# Altium schematic sheet main.SchDoc
size 594 x 420 mm; SheetNumber: 1; SheetTotal: 2
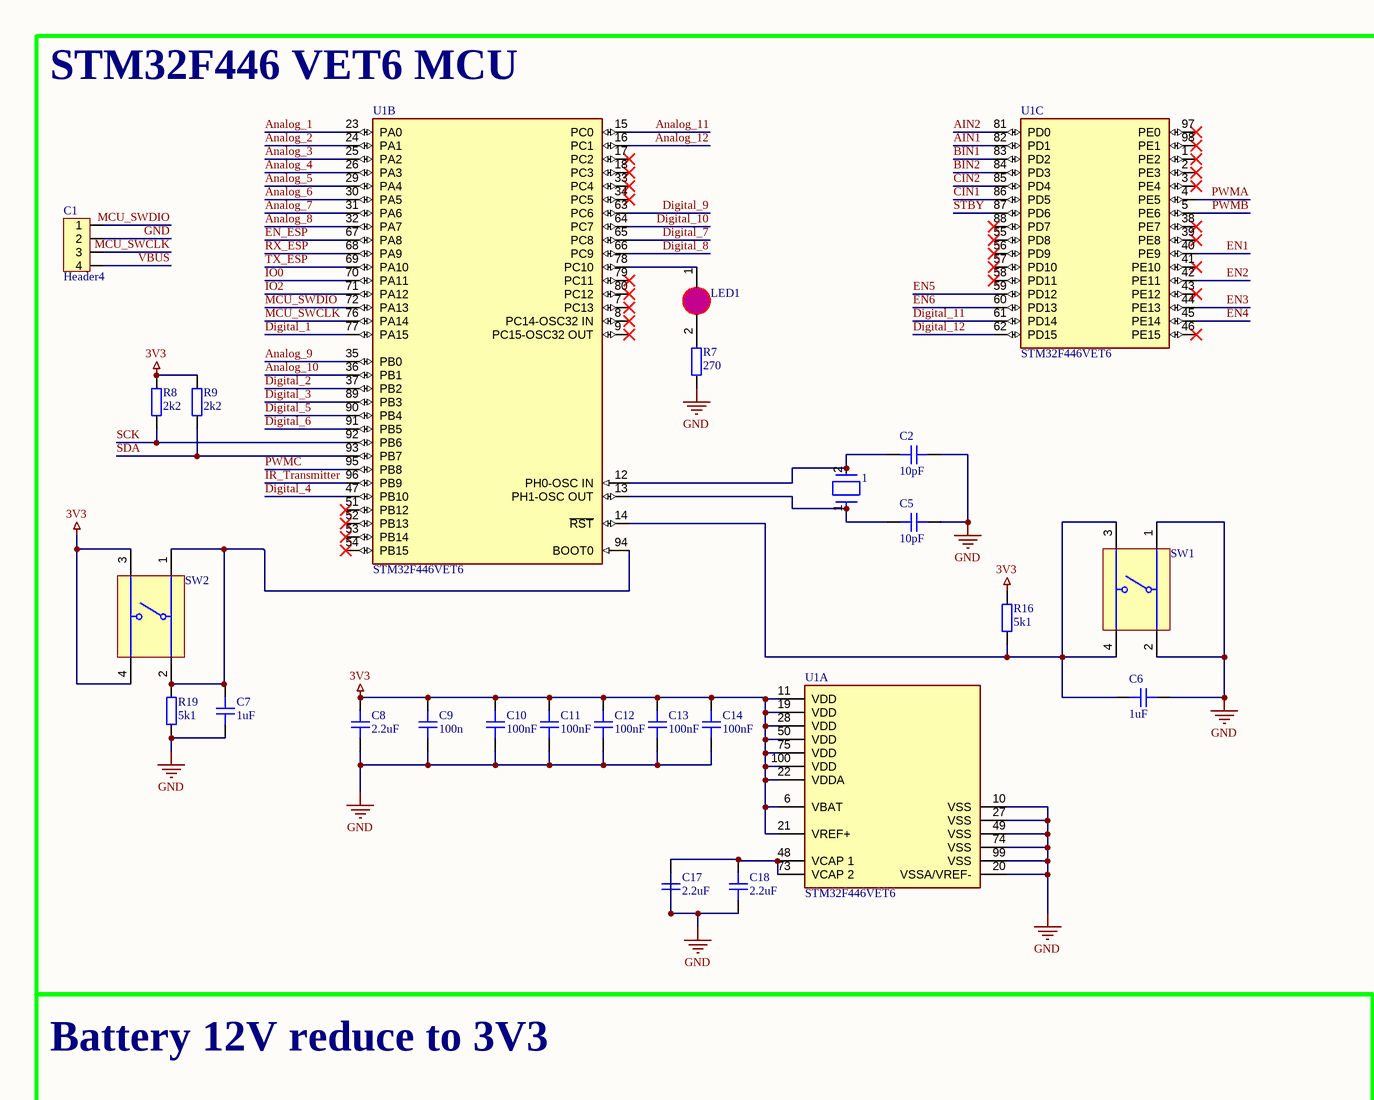
[diagram p0: main.SchDoc, top left]
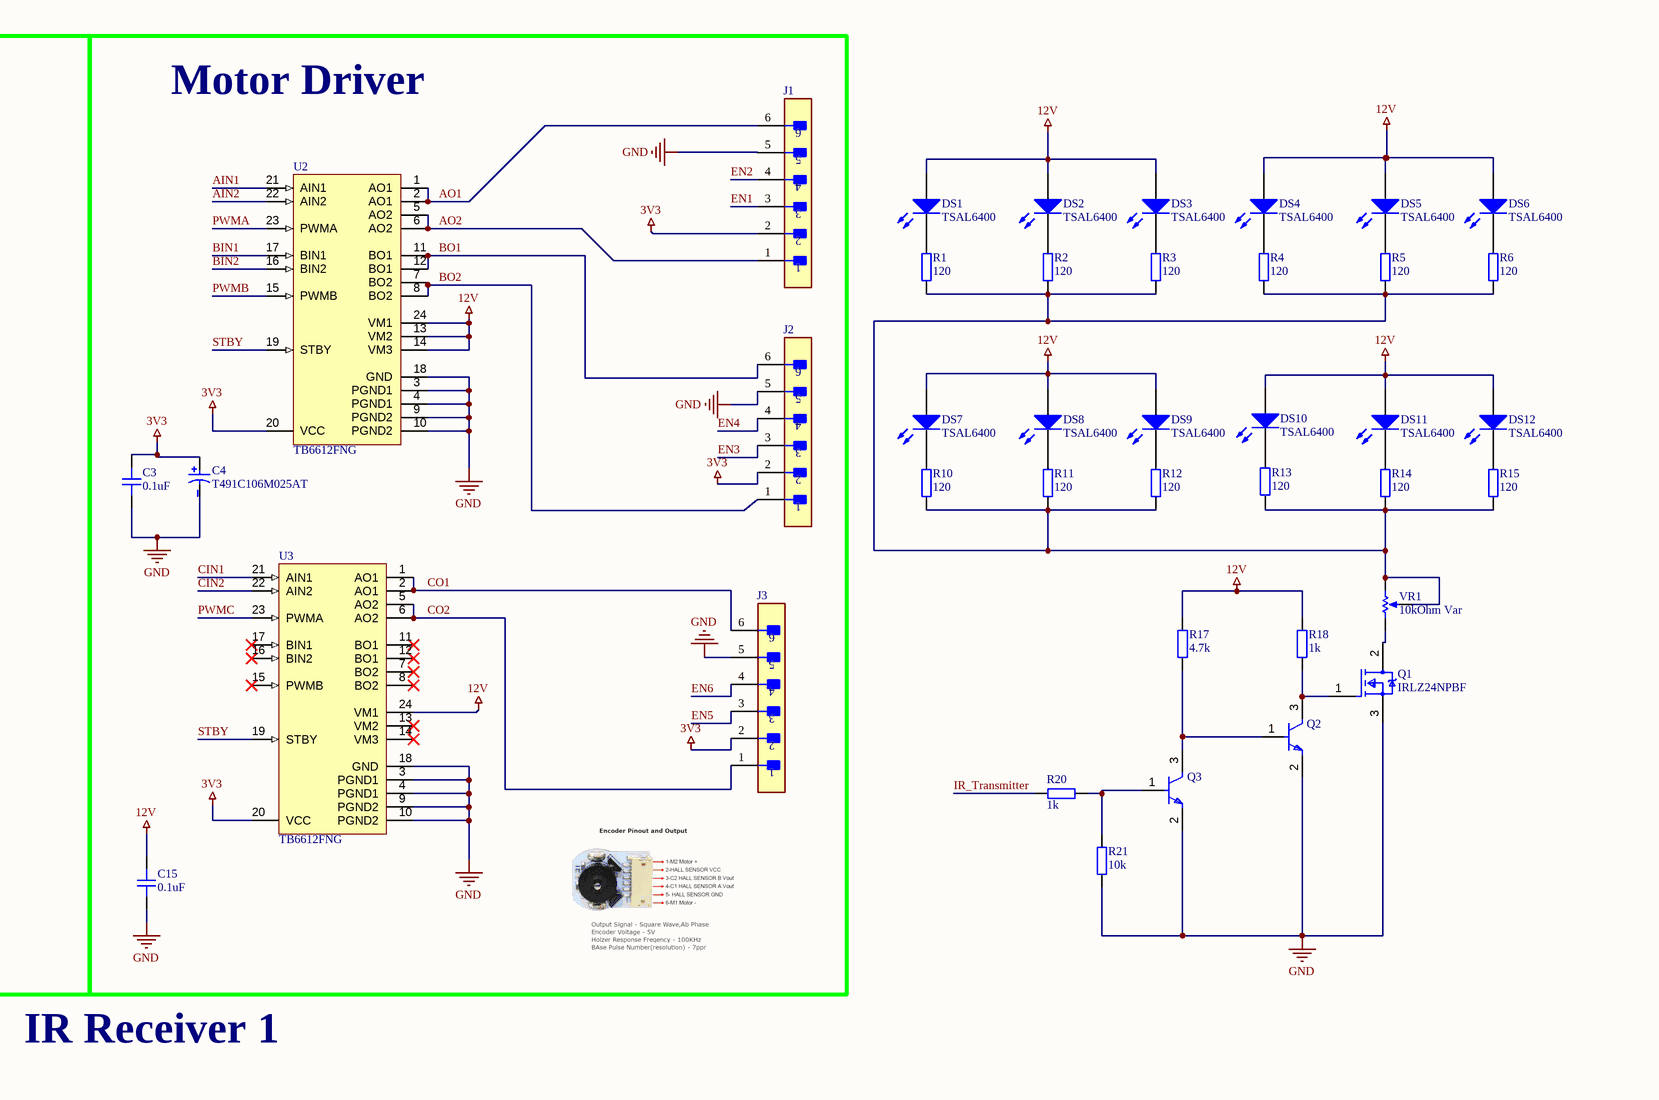
[diagram p1: main.SchDoc, top right]
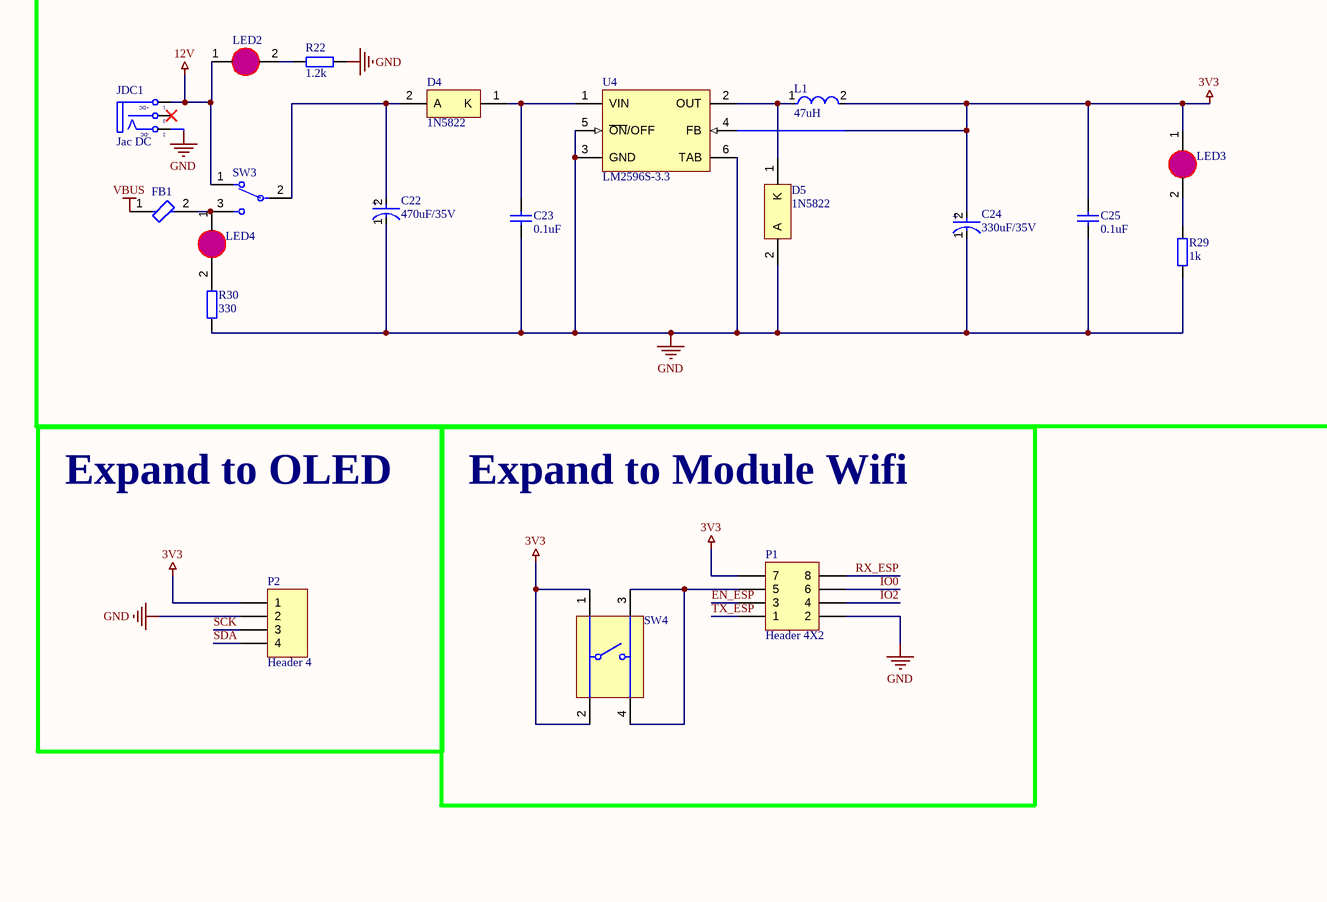
[diagram p2: main.SchDoc, bottom left]
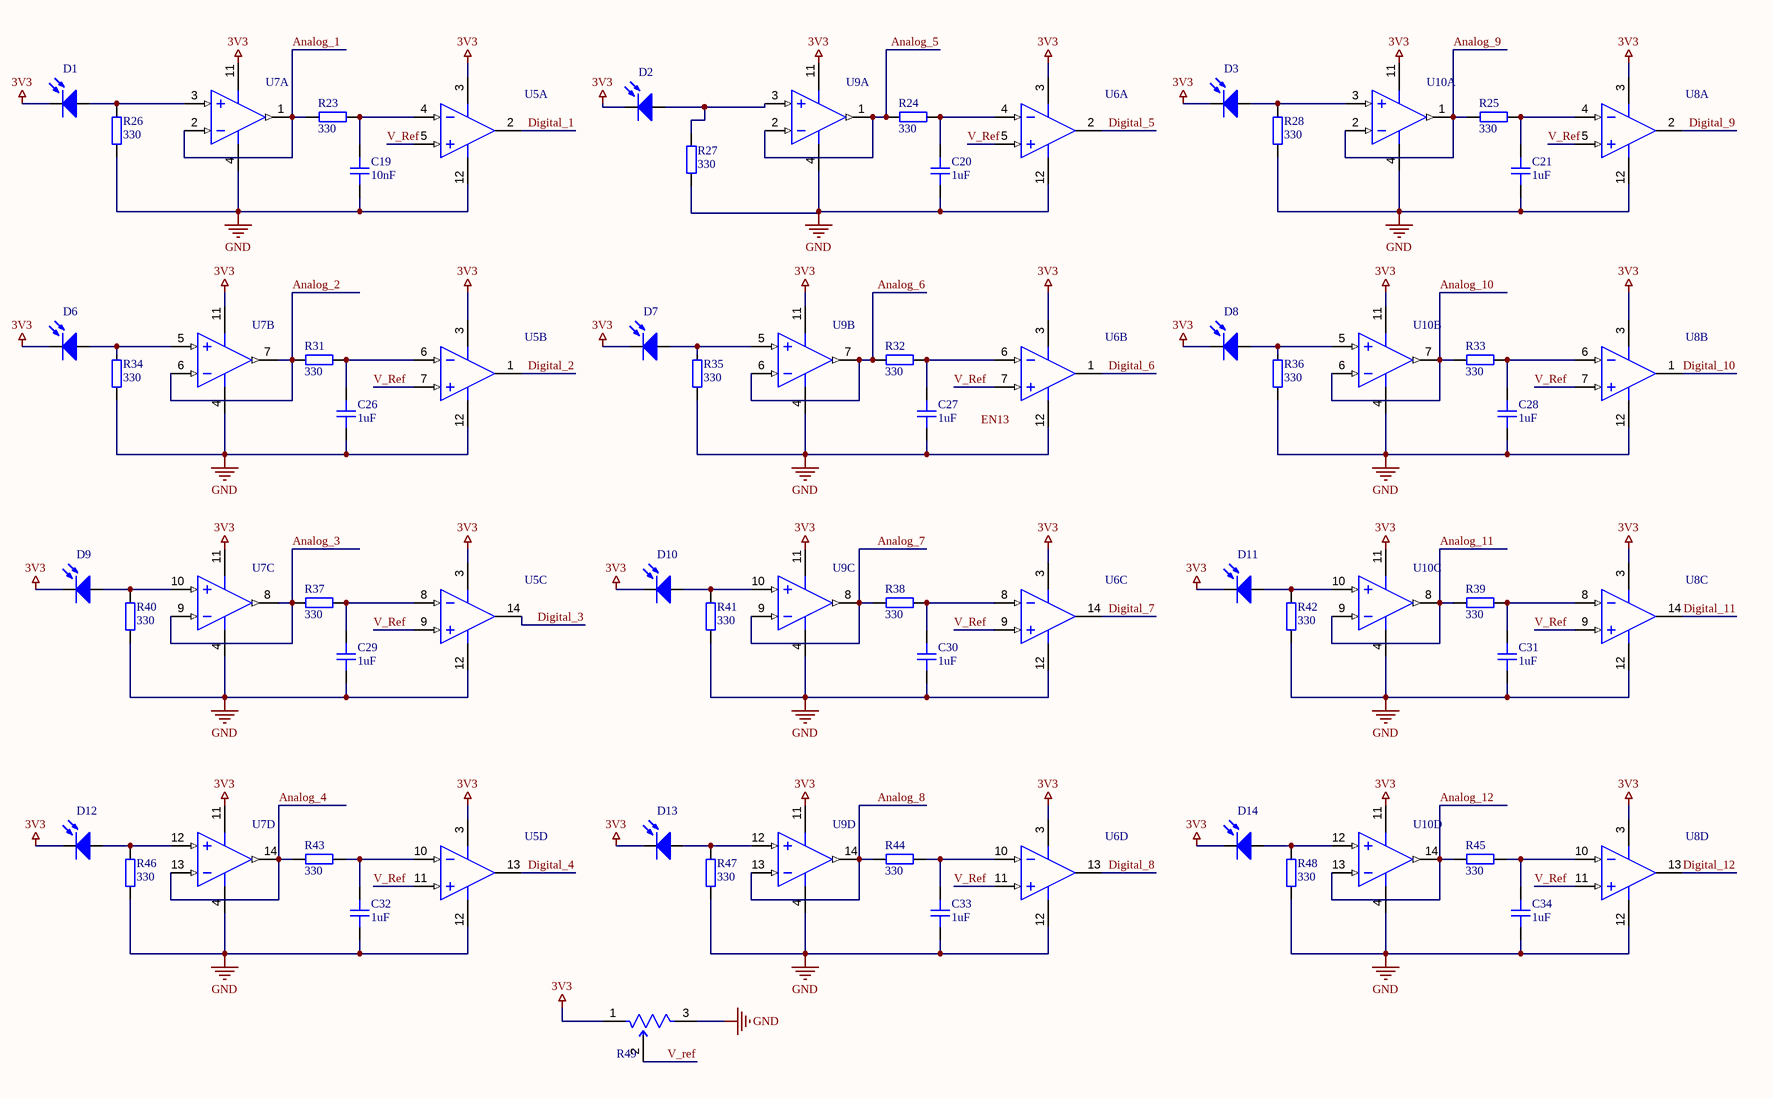
[diagram p3: main.SchDoc, bottom right]

## Parts
1  ABLS-8.000MHZ-B2-T  [FP-ABLS-MFG]  (value not drawn)
C1  Header4  [HDR4]
C2  10pF  [CAP_0603]
C3  0.1uF  [CAP_0603]
C4  T491C106M025AT  [KEMT-T491-C_L]
C5  10pF  [CAP_0603]
C6  1uF  [CAP_0603]
C7  1uF  [CAP_0603]
C8  2.2uF  [CAP_0603]
C9  100n  [CAP_0603]
C10  100nF  [CAP_0603]
C11  100nF  [CAP_0603]
C12  100nF  [CAP_0603]
C13  100nF  [CAP_0603]
C14  100nF  [CAP_0603]
C15  0.1uF  [CAP_0603]
C17  2.2uF  [CAP_0603]
C18  2.2uF  [CAP_0603]
C19  10nF  [CAP_0603]
C20  1uF  [CAP_0603]
C21  1uF  [CAP_0603]
C22  470uF/35V  [FP-RAD-TH-D_10_0_5-L_16_1-MFG]
C23  0.1uF  [CAPC1608X87X35LL15T15]
C24  330uF/35V  [FP-RAD-TH-D_10_0_5-L_12_5-MFG]
C25  0.1uF  [CAPC1608X87X35LL15T15]
C26  1uF  [CAP_0603]
C27  1uF  [CAP_0603]
C28  1uF  [CAP_0603]
C29  1uF  [CAP_0603]
C30  1uF  [CAP_0603]
C31  1uF  [CAP_0603]
C32  1uF  [CAP_0603]
C33  1uF  [CAP_0603]
C34  1uF  [CAP_0603]
D1  Photo Diode  [LED-5 GRe]  (value not drawn)
D2  Photo Diode  [LED-5 GRe]  (value not drawn)
D3  Photo Diode  [LED-5 GRe]  (value not drawn)
D4  1N5822  [ONSC-AXIAL_LEAD-2-267-05_V]
D5  1N5822  [ONSC-AXIAL_LEAD-2-267-05_V]
D6  Photo Diode  [LED-5 GRe]  (value not drawn)
D7  Photo Diode  [LED-5 GRe]  (value not drawn)
D8  Photo Diode  [LED-5 GRe]  (value not drawn)
D9  Photo Diode  [LED-5 GRe]  (value not drawn)
D10  Photo Diode  [LED-5 GRe]  (value not drawn)
D11  Photo Diode  [LED-5 GRe]  (value not drawn)
D12  Photo Diode  [LED-5 GRe]  (value not drawn)
D13  Photo Diode  [LED-5 GRe]  (value not drawn)
D14  Photo Diode  [LED-5 GRe]  (value not drawn)
DS1  TSAL6400  [VISH-TSAL6200]
DS2  TSAL6400  [VISH-TSAL6200]
DS3  TSAL6400  [VISH-TSAL6200]
DS4  TSAL6400  [VISH-TSAL6200]
DS5  TSAL6400  [VISH-TSAL6200]
DS6  TSAL6400  [VISH-TSAL6200]
DS7  TSAL6400  [VISH-TSAL6200]
DS8  TSAL6400  [VISH-TSAL6200]
DS9  TSAL6400  [VISH-TSAL6200]
DS10  TSAL6400  [VISH-TSAL6200]
DS11  TSAL6400  [VISH-TSAL6200]
DS12  TSAL6400  [VISH-TSAL6200]
FB1  BLM18KG101TN1D  [FP-BLM18-0_15-t0_6-d1_2-IPC_B]  (value not drawn)
J1  6B-PH-K-E(LF)(SN)  [FP-B6B-PH-K-E_LF_SN-MFG]  (value not drawn)
J2  B6B-PH-K-E(LF)(SN)  [FP-B6B-PH-K-E_LF_SN-MFG]  (value not drawn)
J3  B6B-PH-K-E(LF)(SN)  [FP-B6B-PH-K-E_LF_SN-MFG]  (value not drawn)
JDC1  Jac DC  [DC-IN]
L1  47uH  [FP-SRR1210-MFG]
LED1  LED  [LED0805]  (value not drawn)
LED2  LED  [LED0805]  (value not drawn)
LED3  LED  [LED0805]  (value not drawn)
LED4  LED  [LED0805]  (value not drawn)
P1  Header 4X2  [HDR2X4]
P2  Header 4  [HDR1X4]
Q1  IRLZ24NPBF  [FP-PG-TO220-3-MFG]
Q2  MMBT2222A,215  [FP-SOT23-IPC_B]  (value not drawn)
Q3  MMBT2222A,215  [FP-SOT23-IPC_B]  (value not drawn)
R1  120  [RES_0603]
R2  120  [RES_0603]
R3  120  [RES_0603]
R4  120  [RES_0603]
R5  120  [RES_0603]
R6  120  [RES_0603]
R7  270  [RES_0603]
R8  2k2  [RES_0603]
R9  2k2  [RES_0603]
R10  120  [RES_0603]
R11  120  [RES_0603]
R12  120  [RES_0603]
R13  120  [RES_0603]
R14  120  [RES_0603]
R15  120  [RES_0603]
R16  5k1  [RES_0603]
R17  4.7k  [RES_0603]
R18  1k  [RES_0603]
R19  5k1  [RES_0603]
R20  1k  [RES_0603]
R21  10k  [RES_0603]
R22  1.2k  [RES_0603]
R23  330  [RES_0603]
R24  330  [RES_0603]
R25  330  [RES_0603]
R26  330  [RES_0603]
R27  330  [RES_0603]
R28  330  [RES_0603]
R29  1k  [RES_0603]
R30  330  [RES_0603]
R31  330  [RES_0603]
R32  330  [RES_0603]
R33  330  [RES_0603]
R34  330  [RES_0603]
R35  330  [RES_0603]
R36  330  [RES_0603]
R37  330  [RES_0603]
R38  330  [RES_0603]
R39  330  [RES_0603]
R40  330  [RES_0603]
R41  330  [RES_0603]
R42  330  [RES_0603]
R43  330  [RES_0603]
R44  330  [RES_0603]
R45  330  [RES_0603]
R46  330  [RES_0603]
R47  330  [RES_0603]
R48  330  [RES_0603]
R49  3386P-1-104LF  [FP-3386P-MFG]  (value not drawn)
SW1  FSM4JSMATR  [TECO-FSM4JSMATR_V]  (value not drawn)
SW2  FSM4JSMATR  [TECO-FSM4JSMATR_V]  (value not drawn)
SW3  JS102011SCQN  [FP-JS102011SCQN-MFG]  (value not drawn)
SW4  FSM4JSMATR  [TECO-FSM4JSMATR_V]  (value not drawn)
U1  STM32F446VET6  [FP-LQFP100-1L-MFG]  (parts A,B,C of 3)
U2  TB6612FNG  [TOSH-SSOP-24_M]
U3  TB6612FNG  [TOSH-SSOP-24_M]
U4  LM2596S-3.3  [KTT0005B_N]
U5  LM339DR2G  [ONSC-SOIC-14-751A-03_V]  (value not drawn)  (parts A,B,C,D of 4)
U6  LM339DR2G  [ONSC-SOIC-14-751A-03_V]  (value not drawn)  (parts A,B,C,D of 4)
U7  LM324M  [D0014A_M]  (value not drawn)  (parts A,B,C,D of 4)
U8  LM339DR2G  [ONSC-SOIC-14-751A-03_V]  (value not drawn)  (parts A,B,C,D of 4)
U9  LM324M  [D0014A_M]  (value not drawn)  (parts A,B,C,D of 4)
U10  LM324M  [D0014A_M]  (value not drawn)  (parts A,B,C,D of 4)
VR1  10kOhm Var  [BOUR-3299W-3_V]

## Blocks framed on the sheet
STM32F446 VET6 MCU: 1 C1 C2 C5-C14 C17 C18 LED1 R7-R9 R16 R19 SW1 SW2 U1
Motor Driver: C3 C4 C15 J1-J3 U2 U3
Battery 12V reduce to 3V3: C22-C25 D4 D5 FB1 JDC1 L1 LED2-LED4 R22 R29 R30 SW3 U4
Expand to OLED: P2
Expand to Module Wifi: P1 SW4

## Nets
3V3: C3.2 C4.1 C8.2 C9.2 C10.2 C11.2 C12.2 C13.2 C14.2 C24.2(A) C25.1 D1.2(K) D2.2(K) D3.2(K) D6.2(K) D7.2(K) D8.2(K) D9.2(K) D10.2(K) D11.2(K) D12.2(K) D13.2(K) D14.2(K) J1.2 J2.2 J3.2 L1.2 LED3.1(A) P1.7 P2.1 R8.2 R9.2 R16.2 R49.1(CCW) SW2.3 SW2.4 SW4.1 SW4.2 U1.6(VBAT) U1.11(VDD) U1.19(VDD) U1.21(VREF+) U1.22(VDDA) U1.28(VDD) U1.50(VDD) U1.75(VDD) U1.100(VDD) U2.20(VCC) U3.20(VCC) U4.4(FB) U5.3(VCC) U6.3(VCC) U7.11(GND) U8.3(VCC) U9.11(GND) U10.11(GND)
12V: C15.2 DS1.1(A) DS2.1(A) DS3.1(A) DS4.1(A) DS5.1(A) DS6.1(A) DS7.1(A) DS8.1(A) DS9.1(A) DS10.1(A) DS11.1(A) DS12.1(A) JDC1.1(T) LED2.1(A) R17.2 R18.2 SW3.1 U2.13(VM2) U2.14(VM3) U2.24(VM1) U3.24(VM1)
GND: C1.2 C2.2 C3.1 C4.2 C5.1 C6.1 C7.1 C8.1 C9.1 C10.1 C11.1 C12.1 C13.1 C14.1 C15.1 C17.1 C18.1 C19.2 C20.2 C21.2 C22.1(C) C23.2 C24.1(C) C25.2 C26.2 C27.2 C28.2 C29.2 C30.2 C31.2 C32.2 C33.2 C34.2 D5.2(A) J1.5 J2.5 J3.5 JDC1.2(TN) P1.2 P2.2 Q1.3(S) Q2.2(E) Q3.2(E) R7.2 R19.1 R21.1 R22.1 R26.2 R27.1 R28.2 R29.2 R30.2 R34.2 R35.2 R36.2 R40.2 R41.2 R42.2 R46.2 R47.2 R48.2 R49.3(CW) SW1.1 SW1.2 U1.10(VSS) U1.20(VSSA/VREF-) U1.27(VSS) U1.49(VSS) U1.74(VSS) U1.99(VSS) U2.3(PGND1) U2.4(PGND1) U2.9(PGND2) U2.10(PGND2) U2.18(GND) U3.3(PGND1) U3.4(PGND1) U3.9(PGND2) U3.10(PGND2) U3.18(GND) U4.3(GND) U4.5(~{ON}/OFF) U4.6(TAB) U5.12(GND) U6.12(GND) U7.4(V+) U8.12(GND) U9.4(V+) U10.4(V+)
VBUS: C1.4 FB1.1
\: U1.89(PB3) U5.14(OUT3)  [also labelled Digital_3]
AIN1: U1.82(PD1) U2.21(AIN1)
AIN2: U1.81(PD0) U2.22(AIN2)
Analog_1: R23.1 U1.23(PA0) U7.1(OUT1) U7.2(IN1-)
Analog_2: R31.1 U1.24(PA1) U7.6(IN2-) U7.7(OUT2)
Analog_3: R37.1 U1.25(PA2) U7.8(OUT3) U7.9(IN3-)
Analog_4: R43.1 U1.26(PA3) U7.13(IN4-) U7.14(OUT4)
Analog_5: R24.1 U1.29(PA4) U9.1(OUT1) U9.2(IN1-)
Analog_6: R32.1 U1.30(PA5) U9.6(IN2-) U9.7(OUT2)
Analog_7: R38.1 U1.31(PA6) U9.8(OUT3) U9.9(IN3-)
Analog_8: R44.1 U1.32(PA7) U9.13(IN4-) U9.14(OUT4)
Analog_9: R25.1 U1.35(PB0) U10.1(OUT1) U10.2(IN1-)
Analog_10: R33.1 U1.36(PB1) U10.6(IN2-) U10.7(OUT2)
Analog_11: R39.1 U1.15(PC0) U10.8(OUT3) U10.9(IN3-)
Analog_12: R45.1 U1.16(PC1) U10.13(IN4-) U10.14(OUT4)
AO1: J1.6 U2.1(AO1) U2.2(AO1)
AO2: J1.1 U2.5(AO2) U2.6(AO2)
BIN1: U1.83(PD2) U2.17(BIN1)
BIN2: U1.84(PD3) U2.16(BIN2)
BO1: J2.6 U2.11(BO1) U2.12(BO1)
BO2: J2.1 U2.7(BO2) U2.8(BO2)
CIN1: U1.86(PD5) U3.21(AIN1)
CIN2: U1.85(PD4) U3.22(AIN2)
CO1: J3.6 U3.1(AO1) U3.2(AO1)
CO2: J3.1 U3.5(AO2) U3.6(AO2)
Digital_1: U1.77(PA15) U5.2(OUT1)
Digital_2: U1.37(PB2) U5.1(OUT2)
Digital_4: U1.47(PB10) U5.13(OUT4)
Digital_5: U1.90(PB4) U6.2(OUT1)
Digital_6: U1.91(PB5) U6.1(OUT2)
Digital_7: U1.65(PC8) U6.14(OUT3)
Digital_8: U1.66(PC9) U6.13(OUT4)
Digital_9: U1.63(PC6) U8.2(OUT1)
Digital_10: U1.64(PC7) U8.1(OUT2)
Digital_11: U1.61(PD14) U8.14(OUT3)
Digital_12: U1.62(PD15) U8.13(OUT4)
EN1: J1.3 U1.40(PE9)
EN2: J1.4 U1.42(PE11)
EN3: J2.3 U1.44(PE13)
EN4: J2.4 U1.45(PE14)
EN5: J3.3 U1.59(PD12)
EN6: J3.4 U1.60(PD13)
EN_ESP: P1.3 U1.67(PA8)
IO0: P1.6 U1.70(PA11)
IO2: P1.4 U1.71(PA12)
IR_Transmitter: R20.2 U1.96(PB9)
MCU_SWCLK: C1.3 U1.76(PA14)
MCU_SWDIO: C1.1 U1.72(PA13)
PWMA: U1.4(PE5) U2.23(PWMA)
PWMB: U1.5(PE6) U2.15(PWMB)
PWMC: U1.95(PB8) U3.23(PWMA)
RX_ESP: P1.8 U1.68(PA9)
SCK: P2.3 R8.1 U1.92(PB6)
SDA: P2.4 R9.1 U1.93(PB7)
STBY: U1.87(PD6) U2.19(STBY) U3.19(STBY)
TX_ESP: P1.1 U1.69(PA10)
V_Ref: R49.2(WIPER) U5.5(IN1+) U5.7(IN2+) U5.9(IN3+) U5.11(IN4+) U6.5(IN1+) U6.7(IN2+) U6.9(IN3+) U6.11(IN4+) U8.5(IN1+) U8.7(IN2+) U8.9(IN3+) U8.11(IN4+)
Net1_1: 1.1 C5.2 U1.13(PH1-OSC_OUT)
Net1_2: 1.2 C2.1 U1.12(PH0-OSC_IN)
NetC6_2: C6.2 R16.1 SW1.3 SW1.4 U1.14(~{RST})
NetC7_2: C7.2 R19.2 SW2.1 SW2.2 U1.94(BOOT0)
NetC17_2: C17.2 C18.2 U1.48(VCAP_1) U1.73(VCAP_2)
NetC19_1: C19.1 R23.2 U5.4(IN1-)
NetC20_1: C20.1 R24.2 U6.4(IN1-)
NetC21_1: C21.1 R25.2 U8.4(IN1-)
NetC22_2: C22.2(A) D4.2(A) SW3.2(C)
NetC23_1: C23.1 D4.1(K) U4.1(VIN)
NetC26_1: C26.1 R31.2 U5.6(IN2-)
NetC27_1: C27.1 R32.2 U6.6(IN2-)
NetC28_1: C28.1 R33.2 U8.6(IN2-)
NetC29_1: C29.1 R37.2 U5.8(IN3-)
NetC30_1: C30.1 R38.2 U6.8(IN3-)
NetC31_1: C31.1 R39.2 U8.8(IN3-)
NetC32_1: C32.1 R43.2 U5.10(IN4-)
NetC33_1: C33.1 R44.2 U6.10(IN4-)
NetC34_1: C34.1 R45.2 U8.10(IN4-)
NetD1_1: D1.1(A) R26.1 U7.3(IN1+)
NetD2_1: D2.1(A) R27.2 U9.3(IN1+)
NetD3_1: D3.1(A) R28.1 U10.3(IN1+)
NetD5_1: D5.1(K) L1.1 U4.2(OUT)
NetD6_1: D6.1(A) R34.1 U7.5(IN2+)
NetD7_1: D7.1(A) R35.1 U9.5(IN2+)
NetD8_1: D8.1(A) R36.1 U10.5(IN2+)
NetD9_1: D9.1(A) R40.1 U7.10(IN3+)
NetD10_1: D10.1(A) R41.1 U9.10(IN3+)
NetD11_1: D11.1(A) R42.1 U10.10(IN3+)
NetD12_1: D12.1(A) R46.1 U7.12(IN4+)
NetD13_1: D13.1(A) R47.1 U9.12(IN4+)
NetD14_1: D14.1(A) R48.1 U10.12(IN4+)
NetDS1_2: DS1.2(K) R1.1
NetDS2_2: DS2.2(K) R2.1
NetDS3_2: DS3.2(K) R3.1
NetDS4_2: DS4.2(K) R4.1
NetDS5_2: DS5.2(K) R5.1
NetDS6_2: DS6.2(K) R6.1
NetDS7_2: DS7.2(K) R10.1
NetDS8_2: DS8.2(K) R11.1
NetDS9_2: DS9.2(K) R12.1
NetDS10_2: DS10.2(K) R13.1
NetDS11_2: DS11.2(K) R14.1
NetDS12_2: DS12.2(K) R15.1
NetFB1_2: FB1.2 LED4.1(A) SW3.3
NetLED1_1: LED1.1(A) U1.78(PC10)
NetLED1_2: LED1.2(K) R7.1
NetLED2_2: LED2.2(K) R22.2
NetLED3_2: LED3.2(K) R29.1
NetLED4_2: LED4.2(K) R30.1
NetP1_5: P1.5 SW4.3 SW4.4
NetQ1_1: Q1.1(G) Q2.3(C) R18.1
NetQ1_2: Q1.2(D) VR1.3(CW)
NetQ2_1: Q2.1(B) Q3.3(C) R17.1
NetQ3_1: Q3.1(B) R20.1 R21.2
NetR1_2: R1.2 R2.2 R3.2 R4.2 R5.2 R6.2 R10.2 R11.2 R12.2 R13.2 R14.2 R15.2 VR1.1(CCW) VR1.2(WIPER)

Not connected (* = marked no-connect by the designer): JDC1 3(S)*; U1 1(PE2)* 2(PE3)* 3(PE4)* 7(PC13)* 8(PC14-OSC32_IN)* 9(PC15-OSC32_OUT)* 17(PC2)* 18(PC3)* 33(PC4)* 34(PC5)* 38(PE7)* 39(PE8)* 41(PE10)* 43(PE12)* 46(PE15)* 51(PB12)* 52(PB13)* 53(PB14)* 54(PB15)* 55(PD8)* 56(PD9)* 57(PD10)* 58(PD11)* 79(PC11)* 80(PC12)* 88(PD7)* 97(PE0)* 98(PE1)*; U3 7(BO2)* 8(BO2)* 11(BO1)* 12(BO1)* 13(VM2)* 14(VM3)* 15(PWMB)* 16(BIN2)* 17(BIN1)*

## Notes on the sheet
- IR Receiver 1
- Labels drawn without touching a wire or pin: EN13
- (in symbol CMP-05427-001326-1) +
- (in symbol CMP-05427-001499-1) +
- (in symbol DCIN) +DC; -DC

## Library data of the parts
1 = CMP-27762-009874-1: CRYSTAL 8.0000MHZ 18PF SMD; ESR (Equivalent Series Resistance): 80R; Operating Frequency: 8 MHz; Frequency Stability: 50ppm; Tolerance: 20ppm; Frequency: 8MHz; Min Operating Temperature: -20°C; Lead Free: Lead Free; Width: 4.7mm; Packaging: Tape and Reel; Series: ABLS; Accuracy: 20ppm; Length: 11.4mm; Frequency Tolerance: 20ppm; Termination: SMD/SMT; Number of Pins: 2; Radiation Hardening: No; Depth: 4.7mm; REACH SVHC: No SVHC; Contact Plating: Tin; Load Capacitance: 18pF; Case/Package: SMD/SMT; Mount: Surface Mount; Package Quantity: 1000; Max Operating Temperature: 70°C; Height: 0.165inch; Series Resistance: 80R
C1 = Header4: Header IDC, 4 x 1 Pin Vertical 2.54mm Pitch (Non-Boxed, Male); Manufacturer: W¨¹rth Elektronik eiSos GmbH; partNo: 613002143121; ComponentLink1 Description: Manufacturer; ComponentLink2 Description: Datasheet; NoPins: 02; Created Date: 29 March 2013; ComponentLink1URL: http://www.we-online.com; ComponentLink2URL: http://katalog.we-online.de/em/datasheet/6130xx143121.pdf; Created by: Karrer Zheng
C2 C3 C5-C15 C17-C21 C26-C34 = CAP_0603: Capacitor SMD 0603; Manufacturer: *; Manufacturer Part Number: *; Distributor Link: *; LCSC: *; Rating: *; Dielectric: *
C4 = CMP-2000-07199-1: Tantalum Surface Mount Capacitor, 10 uF, +/- 20%, 25 V, -55 to 125 degC, 2-Pin SMD, RoHS, Tape and Reel; Manufacturer: Kemet; Product Diameter (mm): NotRequiredmm; Rad Hardened: No; Seal: NotRequired; Product Depth (mm): 3.2mm; ESR: 1.5ohm; Product Length (mm): 6mm; Voltage: 25VDC; DF: 6%; Product Height (mm): 2.5mm; Capacitance: 10000000pF; Polarity: Polar; Case Style: Molded; DCL: 2.5uA; Package Description: 2-Pin Surface Mount Device, Body 6 x 3.2 mm; Case Code: C; Length W/Weld: NotRequiredmm; Length W/Weld (max): NotRequiredmm; Manufacturer URL: http://www.kemet.com/; Mounting Style: SurfaceMount; Tolerance (+ or -): 20%; Failure Rate: NotRequired; Package / Case: 6032-28; Seated Plane Height: NotRequiredmm; Construction: SMTChip; Operating Temp Range: -55Cto125C; Mounting Technology: SurfaceMount; Lead Spacing (nom): NotRequiredmm; Wire Form: NotRequired; Insulation: NotRequired; Datasheet Version: 06/2016; Package Reference: T491-C; Packaging: TapeandReel; Datasheet URL: http://www.kemet.com/Lists/ProductCatalog/Attachments/254/KEM_T2005_T491.pdf
C22 = CMP-05427-001499-1: Aluminum Electrolytic Capacitors (Radial Lead Type) AEC-Q200 Qualified 470uF ±20% 35V; Lead Diameter: 0.6mm; Lead/Base Style: Straight; Polarity: Polar; Life (Hours): 2000Hour; Ripple Current: 460mA; Tolerance: 20%; Termination: Radial; Contact Plating: Tin; Length: 16mm; Voltage Rating: 35V; Max Operating Temperature: 105°C; Construction: RADIAL; Voltage Rating (DC): 35V; Radiation Hardening: No; Packaging: Tape and Reel; Diameter: 10mm; Series: NHG; Case/Package: Radial; Mount: Through Hole; Lead Pitch: 5mm; Height: 16mm; RoHS Compliant: Yes; Height - Seated (Max): 0.669inch; Min Operating Temperature: -55°C; Package Quantity: 500; Capacitance: 470uF
C23 C25 = CMP-2006-03713-1: Part Number: C0603C105K3RACTU; Manufacturer: Kemet
C24 = CMP-05427-001326-1: Aluminum Electrolytic Capacitors (Radial Lead Type) AEC-Q200 Qualified 330uF ±20% 35V; Life (Hours): 2000Hour; Ripple Current (AC): 350mA; Polarity: Polar; Lead Diameter: 0.6mm; Lead/Base Style: Straight; Voltage Rating (DC): 35V; Termination: Radial; Min Operating Temperature: -55°C; Case/Package: Radial; Tolerance: 20%; Construction: RADIAL; Diameter: 10mm; Series: HD; RoHS Compliant: Yes; REACH SVHC: No SVHC; Height: 12.5mm; Voltage Rating: 35V; Voltage: 35V; Max Operating Temperature: 105°C; Capacitance: 330uF; Mount: Through Hole; Lead Pitch: 5mm; Ripple Current: 350mA; Number of Pins: 2; Height - Seated (Max): 0.551inch; Length: 12.5mm; Package Quantity: 200; Packaging: Bulk
D1-D3 D6-D14 = Photo Diode: Photosensitive Diode
D4 D5 = CMP-1055-00007-1: Rectifier, 2-Pin Axial_Lead, Bulk Bag; Manufacturer: On Semiconductor; IFSM Max (A): 80; Note1: 0; Configuration: Single; PartNumber: 1N5822; ComponentLink2Description: Datasheet; RoHS: FALSE; PackageDescription: 2-Pin, Axial Lead, Diameter 5.05 mm; Mounting Technology: Through Hole; PackageReference: AXIAL_LEAD-2-267-05; ComponentLink1URL: http://www.onsemi.com/; PackageVersion: Rev. G, 06/2000; ComponentLink2URL: http://www.onsemi.cn/pub_link/Collateral/1N5820-D.PDF; ComponentLink3Description: Package Specification; ComponentLink1Description: Manufacturer URL; ComponentLink3URL: http://www.onsemi.com/pub_link/Collateral/267-05.PDF; Packing: Bulk Bag; DatasheetVersion: Rev. 10
DS1-DS12 = CMP-2000-07327-1: High Power Infrared Emitting Diode, GaAlAs, MQW, 1.35 V, 100 mA, -40 to 85 degC, 2-Pin THD, RoHS, Bulk; Manufacturer: Vishay; Lum Intensity: 500mW/srmcd; Product Depth (mm): 5.8mm; Type: IrLED; Luminous Intensity: 500mW/sr; Forward Voltage: 3V; Shape Type: Circular; Peak Wavelength: 950nm; Rad Hardened: No; Product Height (mm): 8.7mm; Number of  Elements: 1; Forward Current: 100mA; High Brightness: Yes; Reverse Voltage: 5V; DELETED: Compliant; Power Dissipation: 160W; Viewing Angle: 34deg; Lens Type: Colored; Packaging: Bulk; Lens Dimensions: 5x5x7.7mm; Package Reference: TSAL6200; Chip Material: GaAlAs; Package Description: 2-Pin Through Hole Device, Dia 5.8 mm, Pitch 2.54 mm; Main Category: IrLED; Manufacturer URL: http://www.vishay.com/; Product Length (mm): 5.8mm; Datasheet URL: http://www.vishay.com/docs/81010/tsal6200.pdf; Operating Temperature Classification: Industrial; Package Type: T-13/4; Pin Count: 2; Mounting: ThroughHole; Mounting Technology: ThroughHole; Test Current (It): 100mA; Datasheet Version: Rev. 2.4, 03/2014; Operating Temp Range: -40Cto85C
FB1 = CMP-0686-00548-4: Chip Ferrite Bead Array, 0603, 100Ω @ 100MHz, 25%, 0.03Ω, 3A; Number of Lines: 1; DC Resistance (DCR): 30mR; Impedance: 100R; Max DC Current: 3A; Number of Pins: 2; Tolerance: 25%; Height: 0.8mm; Series: BLM18K; Max Operating Temperature: 125°C; Case Code (Metric): 1608; Current Rating: 3A; Weight: 7.1E-05oz; Core Material: Ferrite; Termination: SMD/SMT; Case Code (Imperial): 0603; Width: 0.8mm; Number of Circuits: 1; Package Quantity: 1; Length: 1.6mm; Min Operating Temperature: -55°C; Lead Free: Lead Free; REACH SVHC: No SVHC; Depth: 0.8mm; Max Current Rating: 3A; Test Frequency: 100MHz; Case/Package: 0603; Material: Ferrite; Packaging: Tape and Reel
J1-J3 = CMP-17439-000406-1: PH Series 6 Position 2.0 mm Pitch Through Hole Top Entry Shrouded Header; Number of Poles: 6; Pitch: 2mm; Lead Free: Lead Free; Width: 4.5mm; Mount: Through Hole; Height: 6mm; Length: 13.9mm
JDC1 = DCIN: Jac DC input; Value: Jac DC
L1 = CMP-07248-000002-1: FIXED IND 68UH 3A 102 MOHM SMD; Manufacturer: Bourns; Manufacturer Part Number: SRR1210-680M; Shielding: true; Q Factor: 12; Series Resistance: 102mΩ; Saturation Current: 2.7A; Tolerance: 20%; Core Material: Ferrite; Self Resonant Frequency: 3.8MHz; Test Frequency: 2.52MHz; ComponentLink2Description: Datasheet; Inductance: 68uH; Rms Current: 3A; Device Class L3: Fixed Inductors; Lead Free: Yes; Composition: Wirewound; Value: 68uH; Temperature: -40°C to +125°C; Automotive: No; RoHS: TRUE; Category: Ind; Device Class L2: Inductors; Height: 10mm; Temperature Range Low: -40°C; Package: SRR1210; Device Class L1: Passive Components; Temperature Range High: +125°C; Mouser Description: Fixed Inductors 68uH 20% SMD 1210; ComponentLink2URL: https://www.bourns.com/docs/Product-Datasheets/SRR1210.pdf; Digikey Description: FIXED IND 68UH 3A 102 MOHM SMD; Octopart: https://octopart.com/srr1210-680m-bourns-10487145
LED1-LED4 = LED0805: LED SMD 0805
P1 = Header 4X2: Header, 4-Pin, Dual row; LatestRevisionDate: 17-Jul-2002; LatestRevisionNote: Re-released for DXP Platform.; Publisher: Altium Limited
P2 = Header 4: Header, 4-Pin, Right Angle; LatestRevisionDate: 17-Jul-2002; LatestRevisionNote: Re-released for DXP Platform.; Publisher: Altium Limited
Q1 = CMP-32901-000966-1: MOSFET N-CH 55V 18A TO220AB; Element Configuration: Single; Turn-On Delay Time: 7.1ns; Max Power Dissipation: 45W; Polarization: N; Turn-Off Delay Time: 20ns; Rds On Max: 60mR; Threshold Voltage: 2V; Input Capacitance: 480pF; Gate to Source Voltage (Vgs): 16V; Drain to Source Resistance: 105mR; Max Dual Supply Voltage: 55V; Drain to Source Voltage (Vdss): 55V; Height: 0.6inch; Number of Pins: 3; Drain to Source Breakdown Voltage: 55V; Power Dissipation: 45W; Packaging: Rail/Tube; Max Operating Temperature: 175°C; Halogen Free: Halogen Free; Case/Package: TO-220; Length: 0.414inch; Min Operating Temperature: -55°C; RoHS Compliant: Yes; Mount: Through Hole; Width: 0.185inch; REACH SVHC: No SVHC; Series: HEXFET®; Lead Free: Lead Free; Continuous Drain Current (ID): 18A
Q2 Q3 = CMP-14406-000037-1: TRANS NPN 40V 600MA TO236AB; RoHS Compliant: Yes
R1-R48 = RES_0603: Resistor SMD 0603; Manufacturer: *; Manufacturer Part Number: *; Distributor Link: *; LCSC: *
R49 = CMP-2000-05592-8: TRIMMER 100K OHM 0.5W PC PIN TOP; Manufacturer Series: 3386; Resistance Law: Linear; Voltage Rating: 300V; Actuator Orientation: Vertical; Tolerance: 10%; Number of Turns: 1; Resistance: 100kR; Number of Terminals/Pins: 3; Temperature Coefficient: 100ppm/°C; Max Power Dissipation: 500mW; Actuator Type: SCREW; Radiation Hardening: No; Package Quantity: 100; Type: Potentiometer; Contact Plating: Tin; RoHS Compliant: Yes; Depth: 9.53mm; Terminal Finish: Tin; Taper: Linear; Color: Blue; Number of Pins: 3; Width: 9.53mm; Lead Free: Contains Lead; Reach SVHC Compliant: Yes; Packaging: Rail/Tube; Min Operating Temperature: -55°C; Max Operating Temperature: 125°C; Technology: CERMET; Height: 4.83mm; Series: Trimpot® 3386 - Sealed; Termination: Pin; Resistance Tolerance: 10%; Power Rating: 500mW; Resistor Type: Cermet; Mount: Through Hole; Military Standard: Not; Length: 9.53mm; Weight: 0.03oz
SW1 SW2 SW4 = CMP-2000-07486-1: Micro Miniature Push Button Switch FSM JSM, 50 mA, -35 to 85 degC, 4-Pin SMD, RoHS, Tape and Reel; Manufacturer: TE Connectivity; Mechanical Life: 100000Cycles; Current Rating: 50mA; Actuator Material: Polyamide; Max Voltage Rating (DC): 12V; Capacitance: 0f; Illumination Type: Illuminated; Voltage Rating (DC): 24V; Case\/Package: SMD/SMT; Operating Force: 160gf; Contact Resistance: 100mOhm; Actuator Length: 0.055inch; Switch Travel: 0.25mm; Throw Configuration: SPST; Termination: GullWing; Contact Plating: Silver; Orientation: Straight; Mounting Technology: SurfaceMount; REACH SVHC: Unknown; Electrical Life: 100000Cycles; Package Reference: FSM4JSMATR; Max Operating Temperature: 85degC; Manufacturer URL: http://www.te.com/; Package Description: 4-Pin Surface Mount Device, Body 6 x 6 mm, Pitch 4.5 mm; Datasheet Version: Rev. V, 02/2015; Packaging: TapeandReel; Min Operating Temperature: -35degC; Mount: SurfaceMount; Contact Current Rating: 50mA; Contact Material: CopperAlloy; Package Quantity: 1200; Datasheet URL: http://www.te.com/commerce/DocumentDelivery/DDEController?Action=showdoc&DocId=Customer+Drawing%7F2-1437565-7%7FV%7Fpdf%7FEnglish%7FENG_CD_2-1437565-7_V.pdf%7F4-1437565-2; RoHSCompliant: true
SW3 = CMP-10038-000023-1: SWITCH SLIDE SPDT 300MA 6V; Electrical Life: 5000Cycles; Actuator Type: Standard; Contact Resistance: 70mR; Actuator Material: Nylon; Max Voltage Rating (DC): 30V; Actuator Length: 2mm; Switch Function: On-On; Actuator Color: Black; Radiation Hardening: No; Throw Configuration: SPDT; Depth: 7.5mm; Case/Package: SMD/SMT; Package Quantity: 4000; Min Operating Temperature: -40°C; Length: 8.5mm; Current Rating: 300mA; Mount: Surface Mount; Voltage Rating (DC): 6V; RoHS Compliant: Yes; Orientation: Straight; Housing Material: Nylon; Contact Plating: Silver; Max Operating Temperature: 85°C; Packaging: Tape and Reel; Switch Travel: 2mm; Max Current Rating: 300mA; Contact Material: Copper Alloy; Series: JS; Termination: Gull Wing
U1 = CMP-12105-000075-1: IC MCU 32BIT 512KB FLASH 100LQFP; Manufacturer: STMicroelectronics; Ram Size: 128KBytes; Data Bus Width: 32bits; Max Junction Temp: +125°C; Number Of Adc Channels: 16; Max Supply Voltage: 3.6V; Nominal Supply Current: 1.4-86mA; Number Of Uart Channels: 6; Core Architecture: ARM Cortex-M4; Standoff Height: 0.05mm; Number Of A/D Converters: 3; Frequency: 180MHz; Number Of Cores: 1; Min Supply Voltage: 1.65V; Number Of Timers/Counters: 14; Number Of Usb Channels: 2; Number Of Spi Channels: 4; Interface: I2C,SPI,UART,USART,Parallel,CAN,USB,LIN,IrDA,I2S,Other; Memory Size: 512KBytes; Number Of I/Os: 81; Ambient Temperature Range High: +85°C; Mouser Description: ARM Microcontrollers - MCU High-performance and DSP with FPU, ARM Cortex-M4 MCU with 512 Kbytes Flash, 180 MHz CPU, Art Accelerator, SDRAM; Device Class L2: Embedded Processors and Controllers; Temperature Range Low: -40°C; Device Class L1: Integrated Circuits (ICs); RoHS: TRUE; Ipc Land Pattern Name: QFP50P1600X1600X160-100; Manufacturer Part Number: STM32F446VET6; Octopart: https://octopart.com/stm32f446vet6-stmicroelectronics-52642922; Package: LQFP100-1L; Automotive: No; Category: IC; ComponentLink2URL: https://www.st.com/resource/en/datasheet/stm32f446ve.pdf; Digikey Description: IC MCU 32BIT 512KB FLASH 100LQFP; Temperature Range High: +85°C; Memory Type: FLASH; Lead Free: Yes; Height: 1.6mm; ComponentLink2Description: Datasheet; Number Of I2C Channels: 4; Device Class L3: Microcontrollers; Temperature: -40°C to +85°C; Ambient Temperature Range Low: -40°C
U2 U3 = CMP-1773-00001-1: Driver IC for Dual DC Motor, 15 V, -20 to 85 degC, 24-Pin SSOP, RoHS, Tape and Reel; Elements: 2; Max Power Dissipation: 200 mW; Max Surge Current: 100 mA; Element Configuration: Common Cathode; Case\Package: TO-236-3; Forward Voltage: 1 V; Peak Reverse Current: 0.1 uA; Forward Current: 70 mA; Recovery Time: 5 ns; Radiation Hardening: No; Packaging: Tape and Reel; ComponentLink2Description: Datasheet; REACH SVHC: No SVHC; ComponentLink2URL: https://toshiba.semicon-storage.com/info/docget.jsp?did=10660&prodName=TB6612FNG; RoHSCompliant: true; DatasheetVersion: Oct-14; PackageDescription: 24-Pin Shrink Small Outline Package Integrated Circuit, Body 7.8 x 5.6 mm, Pitch 0.65 mm; Package Quantity: 3000; Length: 3 mm; Pins: 3; Mount: Surface Mount; ComponentLink1Description: Manufacturer URL; PackageReference: SSOP-24; ComponentLink1URL: http://www.toshiba.com/; Width: 1.4 mm; Max Operating Temperature: 125 degC; Height: 1.1 mm; Min Operating Temperature: -55 degC
U4 = CMP-0069-00276-3: SIMPLE SWITCHER® Power Converter 150 KHz 3A Step-Down Voltage Regulator, 5-pin TO-263; Manufacturer: Texas Instruments; PowerWise: N; PackageTopMarking: NSUZXYTTE#*LM2596S*-3.3 P+; ComponentLink1Description: Datasheet URL; RoHS: N; PackageDescription: TO-263, Molded, .400 x .390 x .180in, 5 Lead, .067in Pitch, Surface Mount; PackageReference: KTT0005B; Code_JEDEC: MO-169-AB; PinCount: 5; ComponentLink1URL: http://www.ti.com/general/docs/lit/getliterature.tsp?genericPartNumber=LM2596&fileType=pdf; CompType: Switcher
U5 U6 U8 = CMP-1305-00036-1: Single Supply Quad Comparators, 0 to 70 degC, 14-Pin SOIC, Pb-Free, Tape and Reel; Manufacturer: On Semiconductor; IO Typ (mA): 16; ComponentLink3URL: http://www.onsemi.com/pub_link/Collateral/751A-03.PDF; RoHS: TRUE; Packing: Tape and Reel; ComponentLink2Description: Datasheet; ComponentLink2URL: http://www.onsemi.com/pub_link/Collateral/LM339-D.PDF; ComponentLink1Description: Manufacturer URL; PackageVersion: Rev. K, 05/2011; DatasheetVersion: Rev. 20; PackageReference: SOIC-14-751A-03; ComponentLink1URL: http://www.onsemi.com/; PartNumber: LM339DR2G; PackageDescription: 14-Pin Small Outline Integrated Circuit, Body 8.65 x 3.9 mm, Pitch 1.27 mm; ComponentLink3Description: Package Specification; Mounting Technology: Surface Mount
U7 U9 U10 = CMP-0055-00738-3: Low Power Quad Operational Amplifier, 14-pin Narrow SOIC; Manufacturer: Texas Instruments; PackageTopMarking: NSUZXYTTE#*LM324M; CompType: Amplifiers; PowerWise: N; Package Reference: D0014A; PackageDescription: Molded Package S.O., .150in Wide, 14 Lead; PinCount: 14; ComponentLink1URL: http://www.ti.com/general/docs/lit/getliterature.tsp?genericPartNumber=LM324-N&fileType=pdf; ComponentLink1Description: Datasheet URL; Code_IPC: SOIC127P600-14; Code_JEDEC: MS-012AB; RoHS: N
VR1 = CMP-2000-05078-1: 3296W-103; Brand: Bourns; Power Rating: 500mW(1/2W); Unit Weight: 0.035000oz; Qualification: Commercial; Element Type: Cermet; Resistance: 10kOhms; Tolerance: 10%; Temperature Coefficient: 100PPM/C; Voltage Rating: 300V; Adjustment: TopCrossed; Product: Multiturn; Datasheet Version: Sep-04; Datasheet URL: https://datasheet.ciiva.com/19482/769696-19482212.pdf; RoHS: True; Tradename: Trimpot; Product Type: SquareTrimmingPotentiometer; Mounting: PanelMount; Packaging: Tube; Package Reference: 3299W; Operating Temperature Range: -55Cto+125C; Length: 10.03mm; Termination Style: Pin; Manufacturer: Bourns; Manufacturer URL: http://www.bourns.com/; Product Category: TrimmerResistors-ThroughHole; Width: 9.53mm; Taper: Linear; Package Description: 3-Pin Surface Mount Device, Body 9.53 x 6.1 mm, Pitch 2.54 mm; Type: Trimmers; Series: 3299